# EAGLE design si1133-breakout (EAGLE 9.6.2)
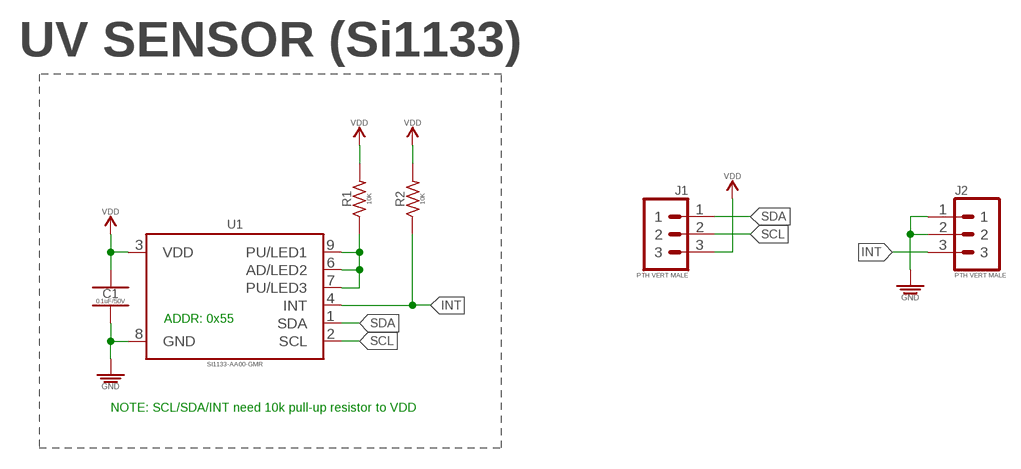
[diagram p0: schematic, sheet 1]

## Parts
C1  0.1uF/50V  0.1UF_SMD-0402_50V-10%  [CAPC1005X55_SMD-0402]
J1  PTH VERT MALE  1X03_PTH_VERT_MALE_2.54MM  [HDRV3W64P254_1X3_762X254X838B]
J2  PTH VERT MALE  1X03_PTH_VERT_MALE_2.54MM  [HDRV3W64P254_1X3_762X254X838B]
R1  10K  10KΩ_SMD-0402_1/16W-5%  [RESC1005X35_SMD-0402]
R2  10K  10KΩ_SMD-0402_1/16W-5%  [RESC1005X35_SMD-0402]
U1  SI1133-AA00-GMR  SI1133  [QFN50P200X200X75-10N]

## Nets
GND: C1.2 J2.1 J2.2 U1.8(GND)
INT: J2.3 R2.1 U1.4(INT)
N$1: R1.1 U1.6(AD/LED2) U1.7(PU/LED3) U1.9(PU/LED1)
SCL: J1.2 U1.2(SCL)
SDA: J1.1 U1.1(SDA)
VDD: C1.1 J1.3 R1.2 R2.2 U1.3(VDD)

## Notes on the sheet
- UV SENSOR (Si1133)
- ADDR: 0x55
- NOTE: SCL/SDA/INT need 10k pull-up resistor to VDD

## Library data of the parts
C1 = _capacitors:0.1UF; DATASHEET: https://product.tdk.com/info/en/catalog/datasheets/mlcc_commercial_soft_en.pdf; DIST: Digikey; DISTLINK: https://www.digikey.com/products/en?keywords=445-173610-1-ND; DISTPN: 445-173610-1-ND; MFR: TDK Corporation; MPN: C1005X7R1H104K050BE
J1 J2 = _connectors:1X03; DATASHEET: https://s3.amazonaws.com/catalogspreads-pdf/PAGE112-113%20.100%20MALE%20HDR.pdf; DIST: Digikey; DISTLINK: https://www.digikey.com/en/products/detail/sullins-connector-solutions/PEC03SAAN/859156?s=N4IgTCBcDaIMoEYAMCwFEC0SDMGByAIiALoC%2BQA; DISTPN: S1012E-03-ND; MFR: Sullins Connector Solutions; MPN: PEC03SAAN
R1 R2 = _resistors:10KΩ; DATASHEET: http://www.yageo.com/NewPortal/yageodocoutput?fileName=/pdf/R-Chip/PYu-RC_51_RoHS_P_0.pdf; DIST: Digikey; DISTLINK: https://www.digikey.com/products/en?keywords=YAG1281CT-ND; DISTPN: YAG1281CT-ND; MFR: Yageo; MPN: RC0402JR-0710KP
U1 = _sensors:SI113: SENSOR OPT 625NM/525NM AMB 10DFN; DATASHEET: https://www.silabs.com/documents/public/data-sheets/Si1133.pdf; DIST: Digikey; DISTLINK: https://www.digikey.com/en/products/detail/silicon-labs/SI1133-AA00-GMR/5725927?s=N4IgTCBcDaIMxwGwFo4BYDsHkEZkDkAREAXQF8g; DISTPN: 336-3477-1-ND; MFR: Silicon Labs; MPN: SI1133-AA00-GMR

## Board
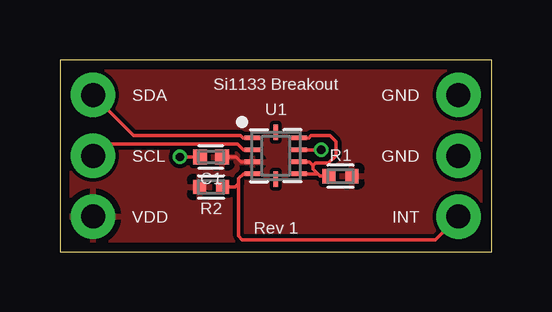
[diagram p1: board, top side]
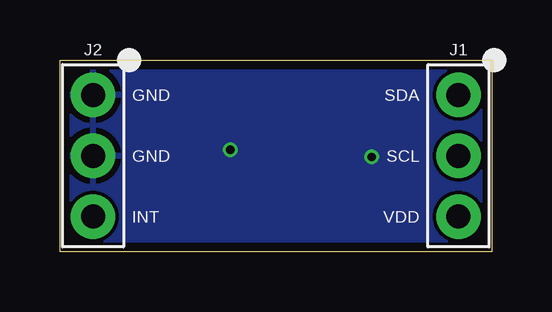
[diagram p2: board, bottom side, seen from below]

Size 18 x 8 mm. Coordinates in mm from the lower left corner, seen from the top.
Outline: 0,0 18,0 18,8 0,8 0,0
Copper layers (1*16): Top 0.035559375mm / dielectric 1.6mm / Bottom 0.035559375mm
Design rules "oshpark-2layer": minimum track width 6mil, minimum drill 10mil, track to track 6mil, track to pad 6mil, pad to pad 6mil, via to via 6mil, smd to smd 6mil, copper to edge 15mil, drill to drill 6mil, minimum pad ring 5mil, minimum via ring 5mil, stop-mask expansion 2.5mil, vias tented up to drill 0mil, thermal gap 10mil

### Footprints (pad centres in the part's own frame; a part is rotated, then mirrored left to right if it is on the bottom)
CAPC1005X55_SMD-0402 = smd 0.585 x 0.612: 1 -0.458,0; 2 0.458,0
HDRV3W64P254_1X3_762X254X838B = drill 1 pad 1.85: 1 -2.54,0; 2 0,0; 3 2.54,0
RESC1005X35_SMD-0402 = smd 0.535 x 0.6: 1 -0.482,0; 2 0.482,0
QFN50P200X200X75-10N = smd 0.65 x 0.17: 1 -0.975,0.75; 2 -0.975,0.25; 3 -0.975,-0.25; 4 -0.975,-0.75; 6 0.975,-0.75; 7 0.975,-0.25; 8 0.975,0.25; 9 0.975,0.75 | smd 0.17 x 0.65: 5 0,-0.975; 10 0,0.975

### Placement (x,y rotation side)
C1  6.3,3.95 180 top
J1  1.38,4 270 bottom
J2  16.62,4 270 bottom
R1  11.7,3.15 0 top
R2  6.3,2.7 180 top
U1  9,4 0 top

### Tracks (layer width: path | path; a pad name or v marks a point on that pad's centre or on a via)
GND  (via drill 0.35 pad 0.15)
  Top 0.152: C1.2 v5,3.95 | U1.8 v10.9,4.25
  pour Bottom: 0,0 18,0 18,8 0,8
INT
  Top 0.152: U1.4 7.65,3.25 7.45,3.05 7.45,2.85 | R2.1 7.3,2.7 7.45,2.85 | J2.3 15.66,0.5 7.6,0.5 7.45,0.65 7.45,2.85
N$1
  Top 0.152: U1.9 10.38,4.75 10.47,4.85 11.25,4.85 11.5,4.6 11.5,4 11.2,3.7 10.65,3.7 10.55,3.6 | U1.7 10.4,3.75 10.55,3.6 | 10.55,3.6 10.55,3.45 10.75,3.25 | 10.75,3.25 10.85,3.15 R1.1 | U1.6 10.75,3.25
SCL
  Top 0.152: U1.2 7.65,4.25 7.4,4.5 1.88,4.5 J1.2
SDA
  Top 0.152: J1.1 3.07,4.85 7.53,4.85 7.62,4.75 U1.1
VDD
  Top 0.152: U1.3 7.55,3.75 7.35,3.95 C1.1
  pour Top: 0,0 18,0 18,8 0,8

### Text on the board
tPlace: SDA | Si1133 Breakout | GND | SCL | GND | VDD | Rev 1 | INT
bPlace: SDA | GND | SCL | GND | VDD | INT